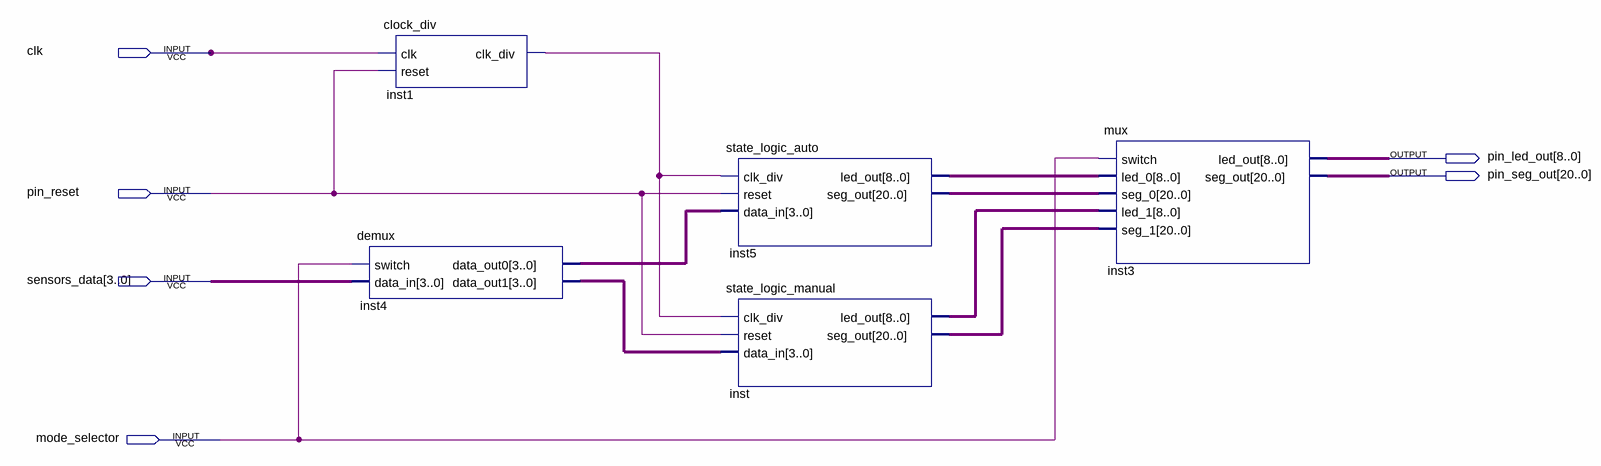
[diagram p0: schematic sheet]
// Quartus schematic coll_avoid_m_top.bdf as structural Verilog: 5 symbols, 6 pins
module coll_avoid_m_top (
  input  clk,
  input  pin_reset,
  input  [3:0] sensors_data,
  input  mode_selector,
  output [8:0] pin_led_out,
  output [20:0] pin_seg_out
);

  wire inst1_clk_div;
  wire [3:0] inst4_data_out0, inst4_data_out1;
  wire [8:0] inst5_led_out, inst_led_out;
  wire [20:0] inst5_seg_out, inst_seg_out;

  clock_div inst1 (.clk(clk), .reset(pin_reset), .clk_div(inst1_clk_div));
  demux inst4 (
    .switch(mode_selector), .data_in(sensors_data), .data_out0(inst4_data_out0), .data_out1(inst4_data_out1));
  state_logic_auto inst5 (
    .clk_div(inst1_clk_div), .reset(pin_reset), .data_in(inst4_data_out0), .led_out(inst5_led_out),
    .seg_out(inst5_seg_out));
  state_logic_manual inst (
    .clk_div(inst1_clk_div), .reset(pin_reset), .data_in(inst4_data_out1), .led_out(inst_led_out),
    .seg_out(inst_seg_out));
  mux inst3 (
    .switch(mode_selector), .led_0(inst5_led_out), .seg_0(inst5_seg_out), .led_1(inst_led_out),
    .seg_1(inst_seg_out), .led_out(pin_led_out), .seg_out(pin_seg_out));
endmodule
